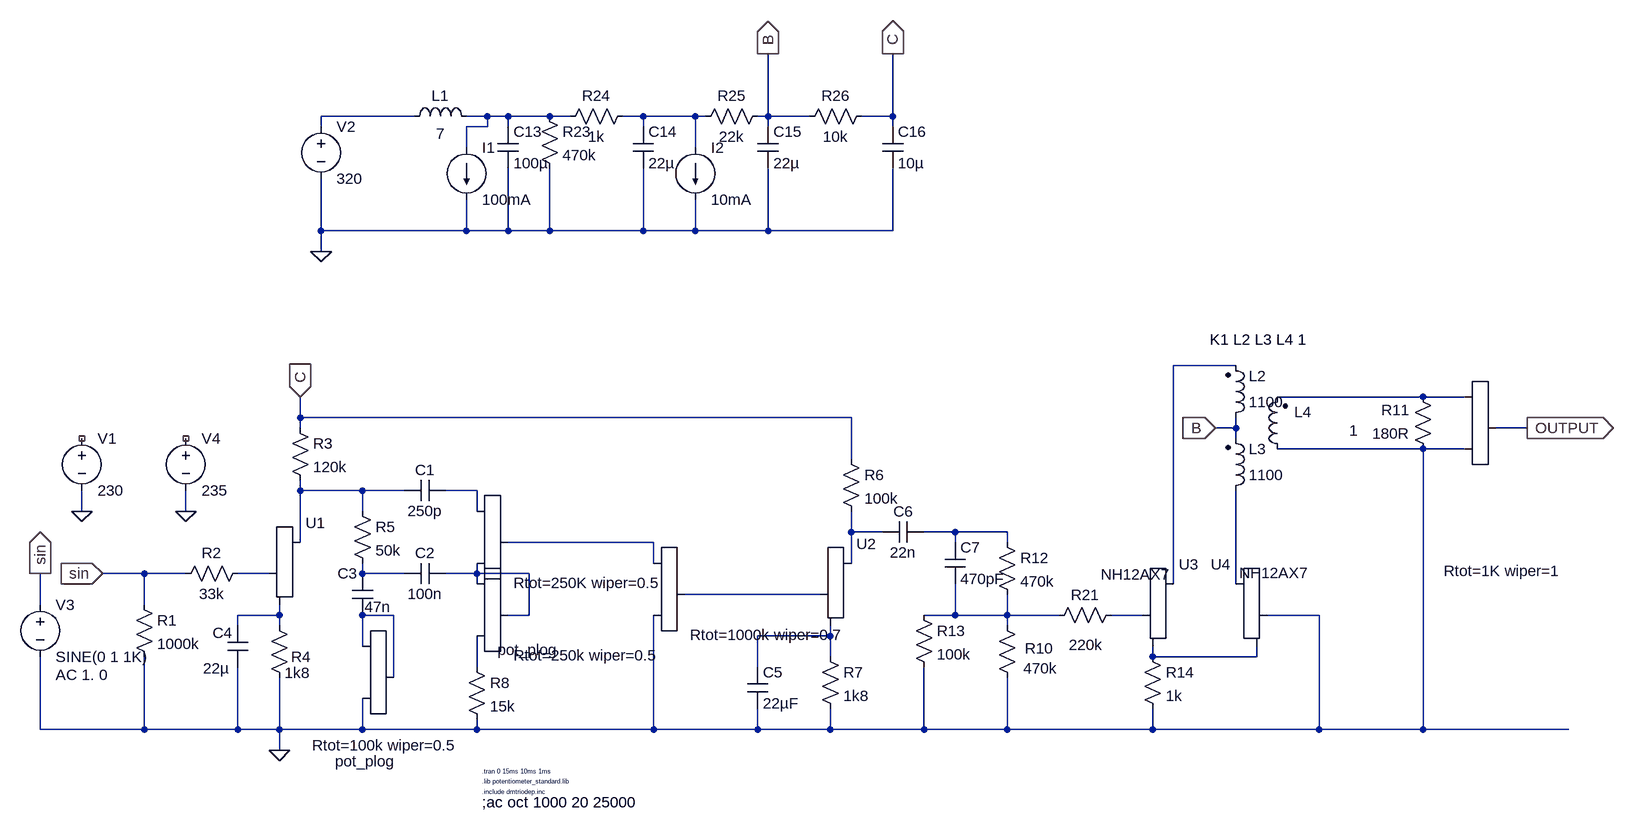
[diagram p0: schematic g5_stompbox.asc]
g5_stompbox.asc, the LTspice schematic file:
Version 4
SHEET 1 3212 900
WIRE 368 -464 224 -464
WIRE 480 -464 448 -464
WIRE 512 -464 480 -464
WIRE 576 -464 512 -464
WIRE 608 -464 576 -464
WIRE 720 -464 688 -464
WIRE 800 -464 720 -464
WIRE 816 -464 800 -464
WIRE 912 -464 912 -560
WIRE 912 -464 896 -464
WIRE 976 -464 912 -464
WIRE 1104 -464 1104 -560
WIRE 1104 -464 1056 -464
WIRE 224 -448 224 -464
WIRE 480 -448 480 -464
WIRE 480 -448 448 -448
WIRE 512 -448 512 -464
WIRE 720 -448 720 -464
WIRE 912 -448 912 -464
WIRE 1104 -448 1104 -464
WIRE 448 -416 448 -448
WIRE 800 -416 800 -464
WIRE 224 -288 224 -368
WIRE 448 -288 448 -336
WIRE 448 -288 224 -288
WIRE 512 -288 512 -384
WIRE 512 -288 448 -288
WIRE 576 -288 576 -384
WIRE 576 -288 512 -288
WIRE 720 -288 720 -384
WIRE 720 -288 576 -288
WIRE 800 -288 800 -336
WIRE 800 -288 720 -288
WIRE 912 -288 912 -384
WIRE 912 -288 800 -288
WIRE 1104 -288 1104 -384
WIRE 1104 -288 912 -288
WIRE 224 -256 224 -288
WIRE 1632 -80 1536 -80
WIRE 1920 -32 1696 -32
WIRE 1984 -32 1920 -32
WIRE 192 0 192 -32
WIRE 1040 0 192 0
WIRE 192 16 192 0
WIRE 1632 16 1632 0
WIRE 1632 16 1600 16
WIRE 2080 16 2032 16
WIRE 1632 32 1632 16
WIRE 1920 48 1696 48
WIRE 1984 48 1920 48
WIRE 1040 64 1040 0
WIRE 192 112 192 96
WIRE 288 112 192 112
WIRE 352 112 288 112
WIRE 464 112 416 112
WIRE -144 144 -144 112
WIRE 16 144 16 112
WIRE 288 144 288 112
WIRE 464 144 464 112
WIRE 1040 176 1040 144
WIRE 1088 176 1040 176
WIRE 1200 176 1152 176
WIRE 1280 176 1200 176
WIRE 192 192 192 112
WIRE 736 192 512 192
WIRE 1200 192 1200 176
WIRE 1280 192 1280 176
WIRE 736 224 736 192
WIRE 1040 224 1040 176
WIRE -48 240 -112 240
WIRE 16 240 -48 240
WIRE 144 240 96 240
WIRE 288 240 288 224
WIRE 352 240 288 240
WIRE 464 240 464 224
WIRE 464 240 416 240
WIRE 544 240 464 240
WIRE 464 256 464 240
WIRE 1536 256 1536 -80
WIRE 1632 256 1632 112
WIRE 992 272 784 272
WIRE -208 288 -208 240
WIRE -48 288 -48 240
WIRE 160 304 160 288
WIRE 160 304 96 304
WIRE 336 304 288 304
WIRE 544 304 544 240
WIRE 544 304 512 304
WIRE 1200 304 1200 256
WIRE 1200 304 1152 304
WIRE 1280 304 1280 272
WIRE 1280 304 1200 304
WIRE 1360 304 1280 304
WIRE 1488 304 1440 304
WIRE 1760 304 1680 304
WIRE 96 320 96 304
WIRE 160 320 160 304
WIRE 1280 320 1280 304
WIRE 1008 336 1008 320
WIRE 1008 336 896 336
WIRE 288 352 288 304
WIRE 1008 368 1008 336
WIRE 1504 368 1504 352
WIRE 1664 368 1664 352
WIRE 1664 368 1504 368
WIRE 464 384 464 336
WIRE 896 384 896 336
WIRE 336 400 336 304
WIRE -208 480 -208 368
WIRE -48 480 -48 368
WIRE -48 480 -208 480
WIRE 96 480 96 384
WIRE 96 480 -48 480
WIRE 160 480 160 400
WIRE 160 480 96 480
WIRE 288 480 288 432
WIRE 288 480 160 480
WIRE 464 480 464 464
WIRE 464 480 288 480
WIRE 736 480 736 304
WIRE 736 480 464 480
WIRE 896 480 896 448
WIRE 896 480 736 480
WIRE 1008 480 1008 448
WIRE 1008 480 896 480
WIRE 1152 480 1152 384
WIRE 1152 480 1008 480
WIRE 1280 480 1280 400
WIRE 1280 480 1152 480
WIRE 1504 480 1504 448
WIRE 1504 480 1280 480
WIRE 1760 480 1760 304
WIRE 1760 480 1504 480
WIRE 1920 480 1920 48
WIRE 1920 480 1760 480
WIRE 2144 480 1920 480
WIRE 160 512 160 480
FLAG 192 -32 C
IOPIN 192 -32 In
FLAG 160 512 0
FLAG 16 144 0
FLAG 912 -560 B
IOPIN 912 -560 Out
FLAG -208 240 sin
IOPIN -208 240 Out
FLAG -112 240 sin
IOPIN -112 240 In
FLAG 1600 16 B
IOPIN 1600 16 In
FLAG 2080 16 OUTPUT
IOPIN 2080 16 Out
FLAG -144 144 0
FLAG 224 -256 0
FLAG 1104 -560 C
IOPIN 1104 -560 Out
SYMBOL res -64 272 R0
SYMATTR InstName R1
SYMATTR Value 1000k
SYMBOL res 112 224 R90
WINDOW 0 0 56 VBottom 2
WINDOW 3 32 56 VTop 2
SYMATTR InstName R2
SYMATTR Value 33k
SYMBOL Misc\\triode 192 240 R0
WINDOW 3 -24 64 Invisible 2
SYMATTR Value NH12AX7
SYMATTR InstName U1
SYMBOL res 176 0 R0
SYMATTR InstName R3
SYMATTR Value 120k
SYMBOL res 144 304 R0
WINDOW 0 34 64 Left 2
WINDOW 3 24 89 Left 2
SYMATTR InstName R4
SYMATTR Value 1k8
SYMBOL cap 416 96 R90
WINDOW 0 0 32 VBottom 2
WINDOW 3 32 32 VTop 2
SYMATTR InstName C1
SYMATTR Value 250p
SYMBOL res 272 128 R0
SYMATTR InstName R5
SYMATTR Value 50k
SYMBOL cap 416 224 R90
WINDOW 0 0 32 VBottom 2
WINDOW 3 32 32 VTop 2
SYMATTR InstName C2
SYMATTR Value 100n
SYMBOL cap 304 304 R180
WINDOW 0 24 64 Left 2
WINDOW 3 -28 13 Left 2
SYMATTR InstName C3
SYMATTR Value 47n
SYMBOL cap 80 320 R0
WINDOW 0 -23 11 Left 2
WINDOW 3 -37 66 Left 2
SYMATTR InstName C4
SYMATTR Value 22µ
SYMBOL potentiometer_standard 448 128 R0
WINDOW 0 48 16 Invisible 2
WINDOW 39 48 112 Invisible 2
SYMATTR InstName U6
SYMATTR SpiceLine ""
SYMATTR Value Rtot=250K wiper=0.5
SYMBOL potentiometer_standard 448 240 R0
WINDOW 0 48 16 Invisible 2
WINDOW 39 48 112 Invisible 2
WINDOW 38 48 117 Left 2
SYMATTR InstName U7
SYMATTR SpiceLine Rtap=25k tap=0.5
SYMATTR SpiceModel pot_plog
SYMATTR Value Rtot=250k wiper=0.5
SYMBOL potentiometer_standard 720 208 R0
WINDOW 0 48 16 Invisible 2
WINDOW 39 48 112 Invisible 2
SYMATTR InstName U9
SYMATTR SpiceLine Rtap=250k tap=0.5
SYMATTR Value Rtot=1000k wiper=0.7
SYMATTR SpiceModel pot_plog
SYMBOL potentiometer_standard 272 336 R0
WINDOW 0 48 16 Invisible 2
WINDOW 39 48 112 Invisible 2
WINDOW 3 -62 168 Left 2
WINDOW 38 -26 193 Left 2
SYMATTR InstName U8
SYMATTR SpiceLine Rtap=10k tap=0.5
SYMATTR Value Rtot=100k wiper=0.5
SYMATTR SpiceModel pot_plog
SYMBOL voltage -208 272 R0
WINDOW 123 24 124 Left 2
WINDOW 39 0 0 Left 2
SYMATTR Value2 AC 1. 0
SYMATTR InstName V3
SYMATTR Value SINE(0 1 1K)
SYMBOL voltage 16 16 R0
WINDOW 123 0 0 Left 2
WINDOW 39 0 0 Left 2
SYMATTR InstName V4
SYMATTR Value 235
SYMBOL Misc\\triode 1040 272 R0
WINDOW 3 -24 64 Invisible 2
SYMATTR Value NH12AX7
SYMATTR InstName U2
SYMBOL res 1024 48 R0
SYMATTR InstName R6
SYMATTR Value 100k
SYMBOL res 992 352 R0
SYMATTR InstName R7
SYMATTR Value 1k8
SYMBOL cap 880 384 R0
SYMATTR InstName C5
SYMATTR Value 22µF
SYMBOL cap 1152 160 R90
WINDOW 0 0 32 VBottom 2
WINDOW 3 32 32 VTop 2
SYMATTR InstName C6
SYMATTR Value 22n
SYMBOL res 1264 304 R0
WINDOW 0 43 51 Left 2
WINDOW 3 41 82 Left 2
SYMATTR InstName R10
SYMATTR Value 470k
SYMBOL res 1264 176 R0
SYMATTR InstName R12
SYMATTR Value 470k
SYMBOL res 1488 352 R0
SYMATTR InstName R14
SYMATTR Value 1k
SYMBOL Misc\\triode 1536 304 R0
WINDOW 3 -112 -63 Left 2
SYMATTR Value NH12AX7
SYMATTR InstName U3
SYMBOL Misc\\triode 1632 304 M0
WINDOW 3 -112 -65 Left 2
SYMATTR Value NH12AX7
SYMATTR InstName U4
SYMBOL res 448 368 R0
SYMATTR InstName R8
SYMATTR Value 15k
SYMBOL voltage -144 16 R0
WINDOW 123 0 0 Left 2
WINDOW 39 0 0 Left 2
SYMATTR InstName V1
SYMATTR Value 230
SYMBOL potentiometer_standard 1968 -48 R0
WINDOW 0 48 16 Invisible 2
WINDOW 39 48 112 Invisible 2
WINDOW 38 48 41 Invisible 2
WINDOW 3 -16 284 Left 2
SYMATTR InstName U10
SYMATTR SpiceLine Rtap=150R tap=0.5
SYMATTR SpiceModel pot_plog
SYMATTR Value Rtot=1K wiper=1
SYMBOL res 1456 288 R90
WINDOW 0 0 56 VBottom 2
WINDOW 3 46 55 VTop 2
SYMATTR InstName R21
SYMATTR Value 220k
SYMBOL voltage 224 -464 R0
WINDOW 123 0 0 Left 2
WINDOW 39 0 0 Left 2
SYMATTR InstName V2
SYMATTR Value 320
SYMBOL cap 496 -448 R0
SYMATTR InstName C13
SYMATTR Value 100µ
SYMATTR SpiceLine V=500V Rser=2
SYMBOL ind 352 -448 R270
WINDOW 0 32 56 VTop 2
WINDOW 3 5 56 VBottom 2
SYMATTR InstName L1
SYMATTR Value 7
SYMATTR SpiceLine Rser=100
SYMBOL res 560 -480 R0
SYMATTR InstName R23
SYMATTR Value 470k
SYMBOL res 704 -480 R90
WINDOW 0 0 56 VBottom 2
WINDOW 3 32 56 VTop 2
SYMATTR InstName R24
SYMATTR Value 1k
SYMBOL cap 704 -448 R0
SYMATTR InstName C14
SYMATTR Value 22µ
SYMATTR SpiceLine Rser=2
SYMBOL cap 896 -448 R0
SYMATTR InstName C15
SYMATTR Value 22µ
SYMATTR SpiceLine Rser=2
SYMBOL res 912 -480 R90
WINDOW 0 0 56 VBottom 2
WINDOW 3 32 56 VTop 2
SYMATTR InstName R25
SYMATTR Value 22k
SYMBOL current 448 -416 R0
WINDOW 123 0 0 Left 2
WINDOW 39 0 0 Left 2
SYMATTR InstName I1
SYMATTR Value 100mA
SYMBOL cap 1088 -448 R0
SYMATTR InstName C16
SYMATTR Value 10µ
SYMATTR SpiceLine Rser=2
SYMBOL res 1072 -480 R90
WINDOW 0 0 56 VBottom 2
WINDOW 3 32 56 VTop 2
SYMATTR InstName R26
SYMATTR Value 10k
SYMBOL current 800 -416 R0
WINDOW 123 0 0 Left 2
WINDOW 39 0 0 Left 2
SYMATTR InstName I2
SYMATTR Value 10mA
SYMBOL res 1936 64 R180
WINDOW 0 36 76 Left 2
WINDOW 3 36 40 Left 2
SYMATTR InstName R11
SYMATTR Value 180R
SYMBOL cap 1184 192 R0
SYMATTR InstName C7
SYMATTR Value 470pF
SYMBOL res 1136 288 R0
SYMATTR InstName R13
SYMATTR Value 100k
SYMBOL ind2 1616 16 M180
WINDOW 0 36 80 Left 2
WINDOW 3 36 40 Left 2
SYMATTR InstName L2
SYMATTR Value 1100
SYMATTR Type ind
SYMBOL ind2 1616 128 M180
WINDOW 0 36 80 Left 2
WINDOW 3 36 40 Left 2
SYMATTR InstName L3
SYMATTR Value 1100
SYMATTR Type ind
SYMBOL ind2 1712 64 R180
WINDOW 0 -37 73 Left 2
WINDOW 3 -108 44 Left 2
SYMATTR InstName L4
SYMATTR Value 1
SYMATTR Type ind
TEXT 472 560 Left 0 !.lib potentiometer_standard.lib
TEXT 472 576 Left 0 !.include dmtriodep.inc
TEXT 472 544 Left 0 !.tran 0 15ms 10ms 1ms
TEXT 472 592 Left 2 !;ac oct 1000 20 25000
TEXT 1592 -120 Left 2 !K1 L2 L3 L4 1

The netlist it stands for:
* g5_stompbox.asc
R1 sin 0 1000k
R2 N011 sin 33k
XU1 N006 N011 N016 NH12AX7
R3 C N006 120k
R4 N016 0 1k8
C1 N007 N006 250p
R5 N006 N012 50k
C2 N013 N012 100n
C3 N017 N012 47n
C4 N016 0 22µ
XU6 N007 N013 N010 Rtot=250K wiper=0.5
XU7 N013 N022 N013 pot_plog Rtot=250k wiper=0.5 Rtap=25k tap=0.5
XU9 N010 0 N015 pot_plog Rtot=1000k wiper=0.7 Rtap=250k tap=0.5
XU8 N017 0 N017 pot_plog Rtot=100k wiper=0.5 Rtap=10k tap=0.5
V3 sin 0 SINE(0 1 1K) AC 1. 0
V4 NC_01 0 235
XU2 N008 N015 N020 NH12AX7
R6 C N008 100k
R7 N020 0 1k8
C5 N020 0 22µF
C6 N009 N008 22n
R10 N018 0 470k
R12 N009 N018 470k
R14 N021 0 1k
XU3 N004 N019 N021 NH12AX7
XU4 N014 0 N021 NH12AX7
R8 N022 0 15k
V1 NC_02 0 230
XU10 N005 0 OUTPUT pot_plog Rtot=1K wiper=1 Rtap=150R tap=0.5
R21 N019 N018 220k
V2 N001 0 320
C13 N002 0 100µ V=500V Rser=2
L1 N001 N002 7 Rser=100
R23 N002 0 470k
R24 N003 N002 1k
C14 N003 0 22µ Rser=2
C15 B 0 22µ Rser=2
R25 B N003 22k
I1 N002 0 100mA
C16 C 0 10µ Rser=2
R26 C B 10k
I2 N003 0 10mA
R11 0 N005 180R
C7 N009 N018 470pF
R13 N018 0 100k
L2 B N004 1100
L3 N014 B 1100
L4 0 N005 1
.lib potentiometer_standard.lib
.include dmtriodep.inc
.tran 0 15ms 10ms 1ms
;ac oct 1000 20 25000
K1 L2 L3 L4 1
.backanno
.end